# Altium schematic sheet OUTPUTs.SchDoc
size A4; SheetNumber: 4; SheetTotal: 5
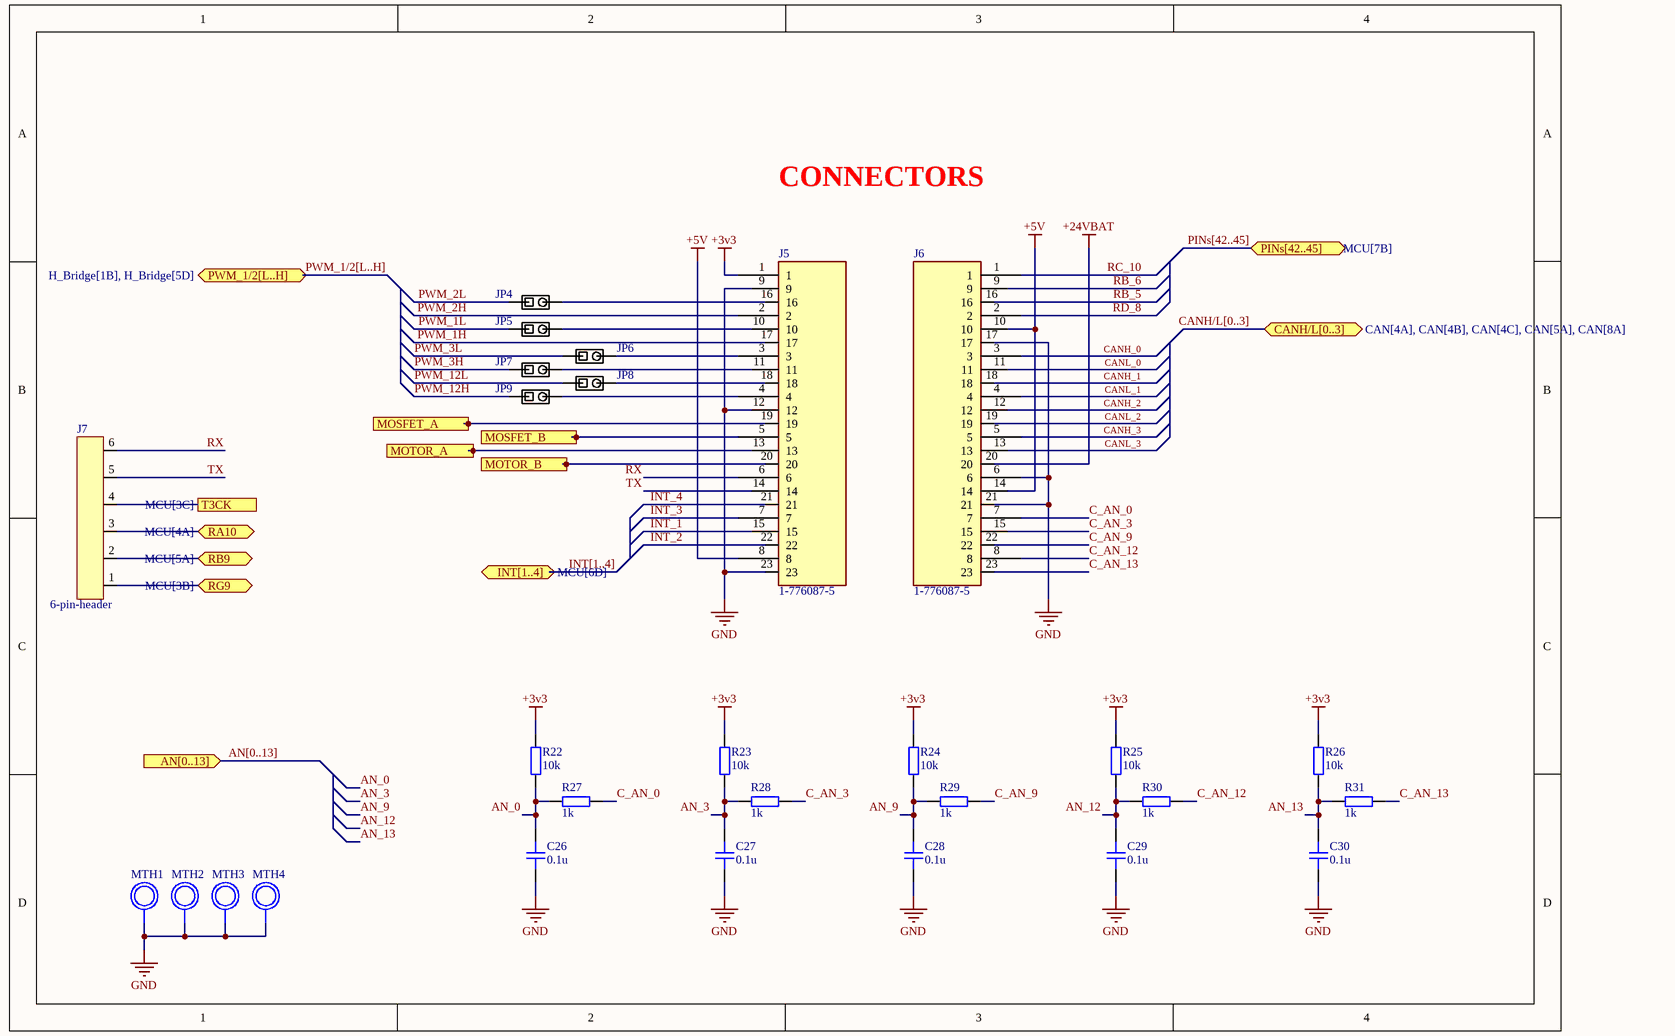
[diagram p0: OUTPUTs.SchDoc]

## Parts
C26  0.1u  [CAP_0805]
C27  0.1u  [CAP_0805]
C28  0.1u  [CAP_0805]
C29  0.1u  [CAP_0805]
C30  0.1u  [CAP_0805]
J5  1-776087-5  [TE_1-776087-5]
J6  1-776087-5  [TE_1-776087-5]
J7  6-pin-header  [G800W302018EU]
JP4  Solder Jumper  [SolderJumper_Single]  (value not drawn)
JP5  Solder Jumper  [SolderJumper_Single]  (value not drawn)
JP6  Solder Jumper  [SolderJumper_Single]  (value not drawn)
JP7  Solder Jumper  [SolderJumper_Single]  (value not drawn)
JP8  Solder Jumper  [SolderJumper_Single]  (value not drawn)
JP9  Solder Jumper  [SolderJumper_Single]  (value not drawn)
MTH1  Mounting_Hole_3.5mm  [Mounting_Hole_3.5mm]  (value not drawn)
MTH2  Mounting_Hole_3.5mm  [Mounting_Hole_3.5mm]  (value not drawn)
MTH3  Mounting_Hole_3.5mm  [Mounting_Hole_3.5mm]  (value not drawn)
MTH4  Mounting_Hole_3.5mm  [Mounting_Hole_3.5mm]  (value not drawn)
R22  10k  [RES_0805]
R23  10k  [RES_0805]
R24  10k  [RES_0805]
R25  10k  [RES_0805]
R26  10k  [RES_0805]
R27  1k  [RES_0805]
R28  1k  [RES_0805]
R29  1k  [RES_0805]
R30  1k  [RES_0805]
R31  1k  [RES_0805]

## Ports
AN[0..13] (in), CANH/L[0..3] (bidir, see CAN[4A], CAN[4B], CAN[4C], CAN[5A], CAN[8A]), INT[1..4] (bidir, see MCU[6D]), MOSFET_A (out, see H_Bridge[4B]), MOSFET_B (out, see H_Bridge[4D]), MOTOR_A (see H_Bridge[7C]), MOTOR_B (see H_Bridge[7C]), PINs[42..45] (bidir, see MCU[7B]), PWM_1/2[L..H] (bidir, see H_Bridge[1B], H_Bridge[5D]), RA10 (bidir, see MCU[4A]), RB9 (bidir, see MCU[5A]), RG9 (bidir, see MCU[3B]), T3CK (see MCU[3C])

## Nets
+3v3: J5.1 R22.2 R23.2 R24.2 R25.2 R26.2
+5V: J5.8 J6.10 J6.14
+24VBAT: J6.20
GND: C26.1 C27.1 C28.1 C29.1 C30.1 J5.9 J5.12 J5.23 J6.6 J6.17 J6.21 MTH1.1 MTH2.1 MTH3.1 MTH4.1
AN_0: C26.2 R22.1 R27.1
AN_3: C27.2 R23.1 R28.1
AN_9: C28.2 R24.1 R29.1
AN_12: C29.2 R25.1 R30.1
AN_13: C30.2 R26.1 R31.1
C_AN_0: J6.7 R27.2
C_AN_3: J6.15 R28.2
C_AN_9: J6.22 R29.2
C_AN_12: J6.8 R30.2
C_AN_13: J6.23 R31.2
CANH_0: J6.3
CANH_1: J6.18
CANH_2: J6.12
CANH_3: J6.5
CANL_0: J6.11
CANL_1: J6.4
CANL_2: J6.19
CANL_3: J6.13
INT_1: J5.15
INT_2: J5.22
INT_3: J5.7
INT_4: J5.21
MOSFET_A: J5.19 ; port MOSFET_A
MOSFET_B: J5.5 ; port MOSFET_B
MOTOR_A: J5.13 ; port MOTOR_A
MOTOR_B: J5.20 ; port MOTOR_B
PWM_1H: J5.17
PWM_1L: JP5.1
PWM_2H: J5.2
PWM_2L: JP4.1
PWM_3H: JP7.1
PWM_3L: JP6.1
PWM_12H: JP9.1
PWM_12L: JP8.1
RA10: J7.3 ; port RA10
RB9: J7.2 ; port RB9
RB_5: J6.16
RB_6: J6.9
RC_10: J6.1
RD_8: J6.2
RG9: J7.1 ; port RG9
RX: J5.6 J7.6
T3CK: J7.4 ; port T3CK
TX: J5.14 J7.5
NetJ5_3: J5.3 JP6.2
NetJ5_4: J5.4 JP9.2
NetJ5_10: J5.10 JP5.2
NetJ5_11: J5.11 JP7.2
NetJ5_16: J5.16 JP4.2
NetJ5_18: J5.18 JP8.2

## Buses and harness runs
bus AN[0..13] = port AN[0..13]
bus CANH/L[0..3] = port CANH/L[0..3]
bus INT[1..4] = port INT[1..4]
bus PINs[42..45] = port PINs[42..45]
bus PWM_1/2[L..H] = port PWM_1/2[L..H]

## Notes on the sheet
- CONNECTORS

## Library data of the parts
C26-C30 = CAP_0805_16V: Capacitor SMD 0805 16V
J5 J6 = 1-776087-5: CONN HDR 23POS R/A W/GASKET AU; MF: {'manufacturer': 'TE Connectivity'}; Package: None; Value: *; Availability: Unavailable; MP: 1-776087-5; Price: None
J7 = G800W302018EU: Pin Header 6 Position 2.54mm Pitch; Manufacturer: Amphenol; Manufacturer Part Number: G800W302018EU
JP4-JP9 = SolderJumper_Single: Solder Jumper Single 0.5mm Pitch
R22-R31 = RES_0805: Resistor SMD 0805